# EAGLE schematic LSS Pro V0.2 TOP (EAGLE 7.6.0)
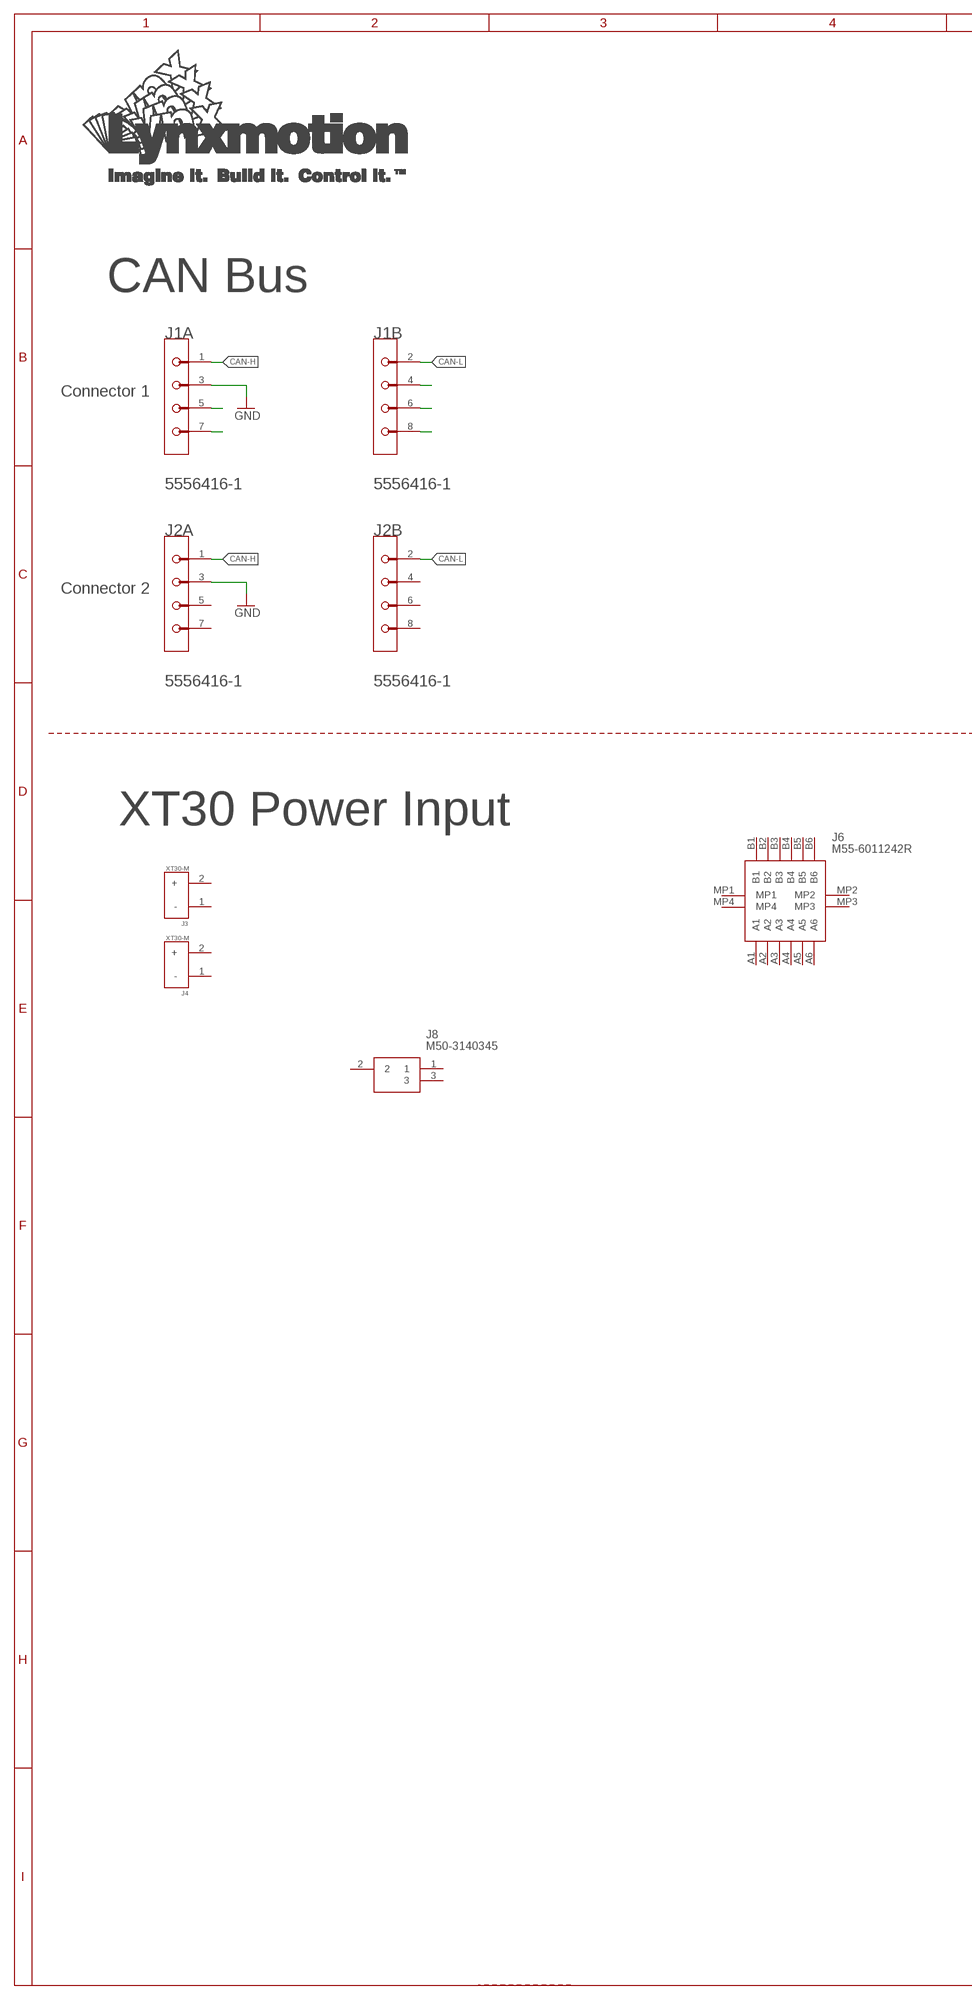
[diagram p0: schematic, sheet 1, part 1 of 2]
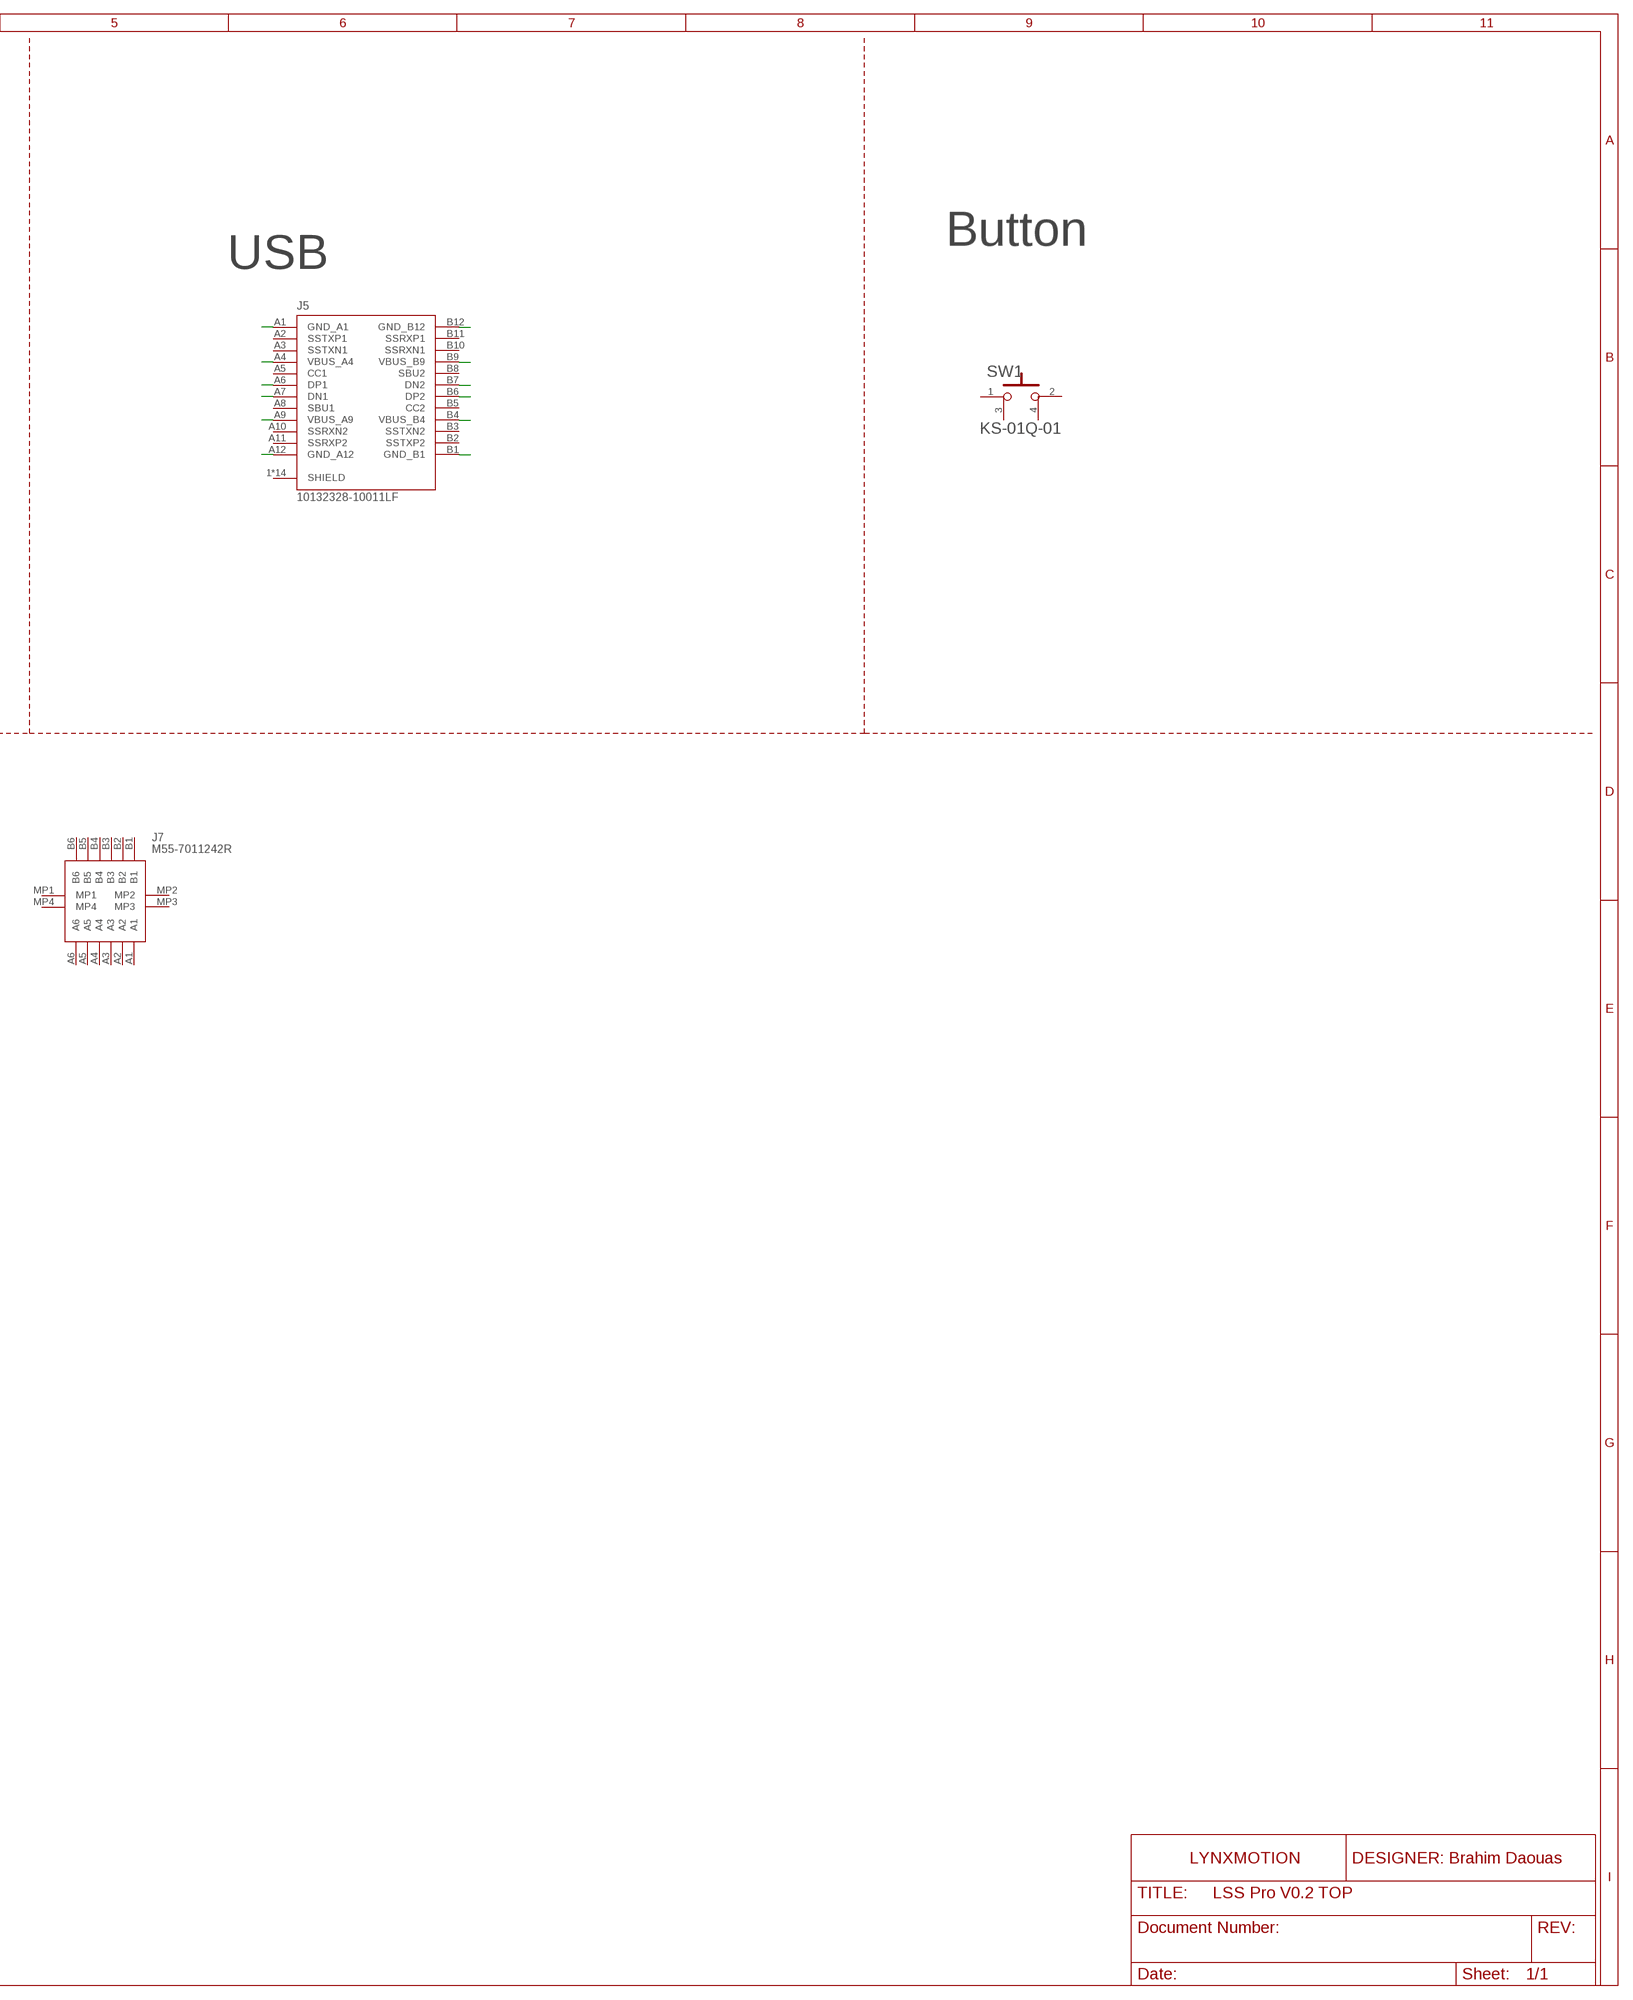
[diagram p1: schematic, sheet 1, part 2 of 2]

## Parts
J1  TE_5556416-1TE_5556416-1_0_0  [TE_5556416-1_0]
J2  TE_5556416-1TE_5556416-1_0_0  [TE_5556416-1_0]
J3  XT30-M  [XT30-M]
J4  XT30-M  [XT30-M]
J5  10132328-10011LF  [AMPHENOL_10132328-10011LF]
J6  M55-6011242R  [M556011242R]
J7  M55-7011242R  [M557011242R]
J8  M50-3140345  [M503140345]
SW1  E-SWITCH_KS-01Q-01E-SWITCH_KS-01Q-01_0_0  [E-SWITCH_KS-01Q-01_0]

## Nets
CAN-H: J1.1 J2.1
CAN-L: J1.2 J2.2
GND: J1.3 J2.3
N$1: J5.A1(GND_A1)
N$2: J5.B12(GND_B12)
N$3: J1.5
N$4: J1.7
N$5: J5.B1(GND_B1)
N$6: J1.4
N$7: J1.6
N$8: J1.8
N$9: J5.A12(GND_A12)
N$10: J5.A9(VBUS_A9)
N$11: J5.B4(VBUS_B4)
N$12: J5.A6(DP1)
N$13: J5.A7(DN1)
N$14: J5.B7(DN2)
N$15: J5.B6(DP2)
N$16: J5.A4(VBUS_A4)
N$17: J5.B9(VBUS_B9)
Unconnected: J2.4 J2.5 J2.6 J2.7 J2.8 J3.1(-) J3.2(+) J4.1(-) J4.2(+) J5.1(SHIELD) J5.2(SHIELD) J5.3(SHIELD) J5.4(SHIELD) J5.5(SHIELD) J5.6(SHIELD) J5.7(SHIELD) J5.8(SHIELD) J5.9(SHIELD) J5.10(SHIELD) J5.11(SHIELD) J5.12(SHIELD) J5.13(SHIELD) J5.14(SHIELD) J5.A2(SSTXP1) J5.A3(SSTXN1) J5.A5(CC1) J5.A8(SBU1) J5.A10(SSRXN2) J5.A11(SSRXP2) J5.B2(SSTXP2) J5.B3(SSTXN2) J5.B5(CC2) J5.B8(SBU2) J5.B10(SSRXN1) J5.B11(SSRXP1) J6.A1 J6.A2 J6.A3 J6.A4 J6.A5 J6.A6 J6.B1 J6.B2 J6.B3 J6.B4 J6.B5 J6.B6 J6.MP1 J6.MP2 J6.MP3 J6.MP4 J7.A1 J7.A2 J7.A3 J7.A4 J7.A5 J7.A6 J7.B1 J7.B2 J7.B3 J7.B4 J7.B5 J7.B6 J7.MP1 J7.MP2 J7.MP3 J7.MP4 J8.1 J8.2 J8.3 SW1.1 SW1.2 SW1.3 SW1.4

## Notes on the sheet
- Button
- USB
- CAN Bus
- Connector 1
- Connector 2
- XT30 Power Input

## Library data of the parts
J1 J2 = TE - 5556416-1:TE_5556416-1: CONN MOD JACK 8P8C; CENTROID_NOT_SPECIFIED: No; CONN_GENDER: Female; CONN_ORIENTATION: Vertical; CONTACT_MATERIAL: Gold; CURRENT_RATING: 1.5A; DATASHEET: http://www.te.com/commerce/DocumentDelivery/DDEController?Action=showdoc&DocId=Customer+Drawing%7F5556416%7FC1%7Fpdf%7FEnglish%7FENG_CD_5556416_C1.pdf%7F5556416-1; DEVICE_CLASS_L1: Connectors; DEVICE_CLASS_L2: Modular / Ethernet Connectors; DEVICE_CLASS_L3: unset; DIGIKEY_DESCRIPTION: CONN MOD JACK 8P8C VERT UNSHLD; DIGIKEY_PART_NUMBER: A31428-ND; HEIGHT: 16.51mm; IS_FEMALE: yes; LEAD_FREE: yes; MF: TE; MFG_PACKAGE_IDENT: 5556416-1; MFG_PACKAGE_IDENT_DATE: 0; MFG_PACKAGE_IDENT_REV: 0; MOUSER_DESCRIPTION: CONN MOD JACK 8P8C VERT UNSHLD; MOUSER_PART_NUMBER: 571-5556416-1; MPN: 5556416-1; NUMBER_OF_CONTACTS: 8; PACKAGE: CONN_16MM64_15MM88; PREFIX: J; ROHS: yes; TEMPERATURE_RANGE_HIGH: +85°C; TEMPERATURE_RANGE_LOW: -40°C; VERIFICATION_VERSION: 0.0.0.1; VOLTAGE_RATING: 150V
J3 J4 = LSS_Pro:XT30-M: DC supply; XT60; male; PIN:2; for cable; soldered; 60A; 500V; AVAILABILITY: Unavailable; MF: AMASS; MP: XT60-M; PACKAGE: Package Analog Devices; PRICE: None
J5 = 10132328-10011LF:10132328-10011LF: USB 3.1 TYPE-C Vertical Receptable; AVAILABILITY: Unavailable; DESCRIPTION: USB 3.1 GEN 2 Type C Connector, Input Output Connector, VERTICAL RECEPTACLE; DIGIKEY-PURCHASE-URL: https://snapeda.com/shop?store=DigiKey&id=4791688; MF: FCI; MOUSER-PURCHASE-URL: https://snapeda.com/shop?store=Mouser&id=4791688; MP: 10132328-10011LF; PACKAGE: None; PRICE: None
J6 = M55-6011242R:M55-6011242R: HARWIN - M55-6011242R - Board-To-Board Connector, 1.27 mm, 12 Contacts, Receptacle, Archer Kontrol M55-601 Series Source: Datasheet <https://cdn.harwin.com/pdfs/M55-60X.pdf>; ARROW_PART_NUMBER: M55-6011242R; DESCRIPTION: HARWIN - M55-6011242R - Board-To-Board Connector, 1.27 mm, 12 Contacts, Receptacle, Archer Kontrol M55-601 Series; HEIGHT: 9.25mm; MANUFACTURER_NAME: Harwin; MANUFACTURER_PART_NUMBER: M55-6011242R; MOUSER_PART_NUMBER: 855-M55-6011242R; MOUSER_PRICE-STOCK: https://www.mouser.co.uk/ProductDetail/Harwin/M55-6011242R?qs=rrS6PyfT74fV1TzysAd0Eg%3D%3D
J7 = M55-7011242R:M55-7011242R: HARWIN - M55-7011242R - CONNECTOR, HEADER, 12POS, 2ROW, 1.27MM Source: Datasheet <https://componentsearchengine.com/Datasheets/1/M55-7011242R.pdf>; ARROW_PART_NUMBER: M55-7011242R; DESCRIPTION: HARWIN - M55-7011242R - CONNECTOR, HEADER, 12POS, 2ROW, 1.27MM; HEIGHT: 8.45mm; MANUFACTURER_NAME: Harwin; MANUFACTURER_PART_NUMBER: M55-7011242R; MOUSER_PART_NUMBER: 855-M55-7011242R; MOUSER_PRICE-STOCK: https://www.mouser.com/Search/Refine.aspx?Keyword=855-M55-7011242R
J8 = M50-3140345:M50-3140345: Headers & Wire Housings 3 WAY SIL VERT SMT SKT Source: Datasheet <https://cdn.harwin.com/pdfs/M50-314.pdf>; ARROW_PART_NUMBER: M50-3140345; DESCRIPTION: Headers & Wire Housings 3 WAY SIL VERT SMT SKT; HEIGHT: 3.55mm; MANUFACTURER_NAME: Harwin; MANUFACTURER_PART_NUMBER: M50-3140345; MOUSER_PART_NUMBER: 855-M50-3140345; MOUSER_PRICE-STOCK: https://www.mouser.co.uk/ProductDetail/Harwin/M50-3140345?qs=%252BdQmOuGyFcGEXufOLF1LLg%3D%3D
SW1 = D6R90 F2 LFS:E-SWITCH_KS-01Q-01: Pushbutton Switch SPST-NO Standard Through Hole; ACTUATOR_TYPE: Round, Button; CAPACITANCE: 1.0pF; CURRENT_RATING: 10mA (DC); DATASHEET: https://upverter.com/datasheet/3b708556f29b55c7f5db677c77a74973be95ebea.pdf; DIGIKEY_DESCRIPTION: SWITCH Pushbutton Switch SPST-NO Standard Through Hole; DIGIKEY_PART_NUMBER: EG4791-ND; ELECTRICAL_LIFE: 250,000 Cycles; IMPORTED_FROM: octopart; LEAD_FREE: yes; MECHANICAL_LIFE: 500,000 Cycles; MF: E-Switch; MFG_PACKAGE_IDENT: 29-KS01Q01; MOUSER_PART_NUMBER: 612-KS-01Q-01; MPN: KS-01Q-01; NUM_PINS: 4; OCTOPART_PART_NUMBER: 72a6bab923faad61; PACKAGE: SW_PTH_12MM; PREFIX: SW; ROHS: yes; TEMPERATURE_RANGE_HIGH: +85°C; TEMPERATURE_RANGE_LOW: -20°C; VOLTAGE_RATING_-_DC: 35V; VOLTAGE_RATING_AC: 35 V

## Net classes
1 vcc: width 0.305 mm
2 Power: width 0.203 mm, drill 0.305 mm, clearance 0.152 mm to class 0, clearance 0.152 mm to class 1, clearance 0.152 mm
3 usb diff pairs: width 0.254 mm